# EasyEDA Pro project ProPrj_DiscoTech 6 Current_2026-05-06.epro, board Input
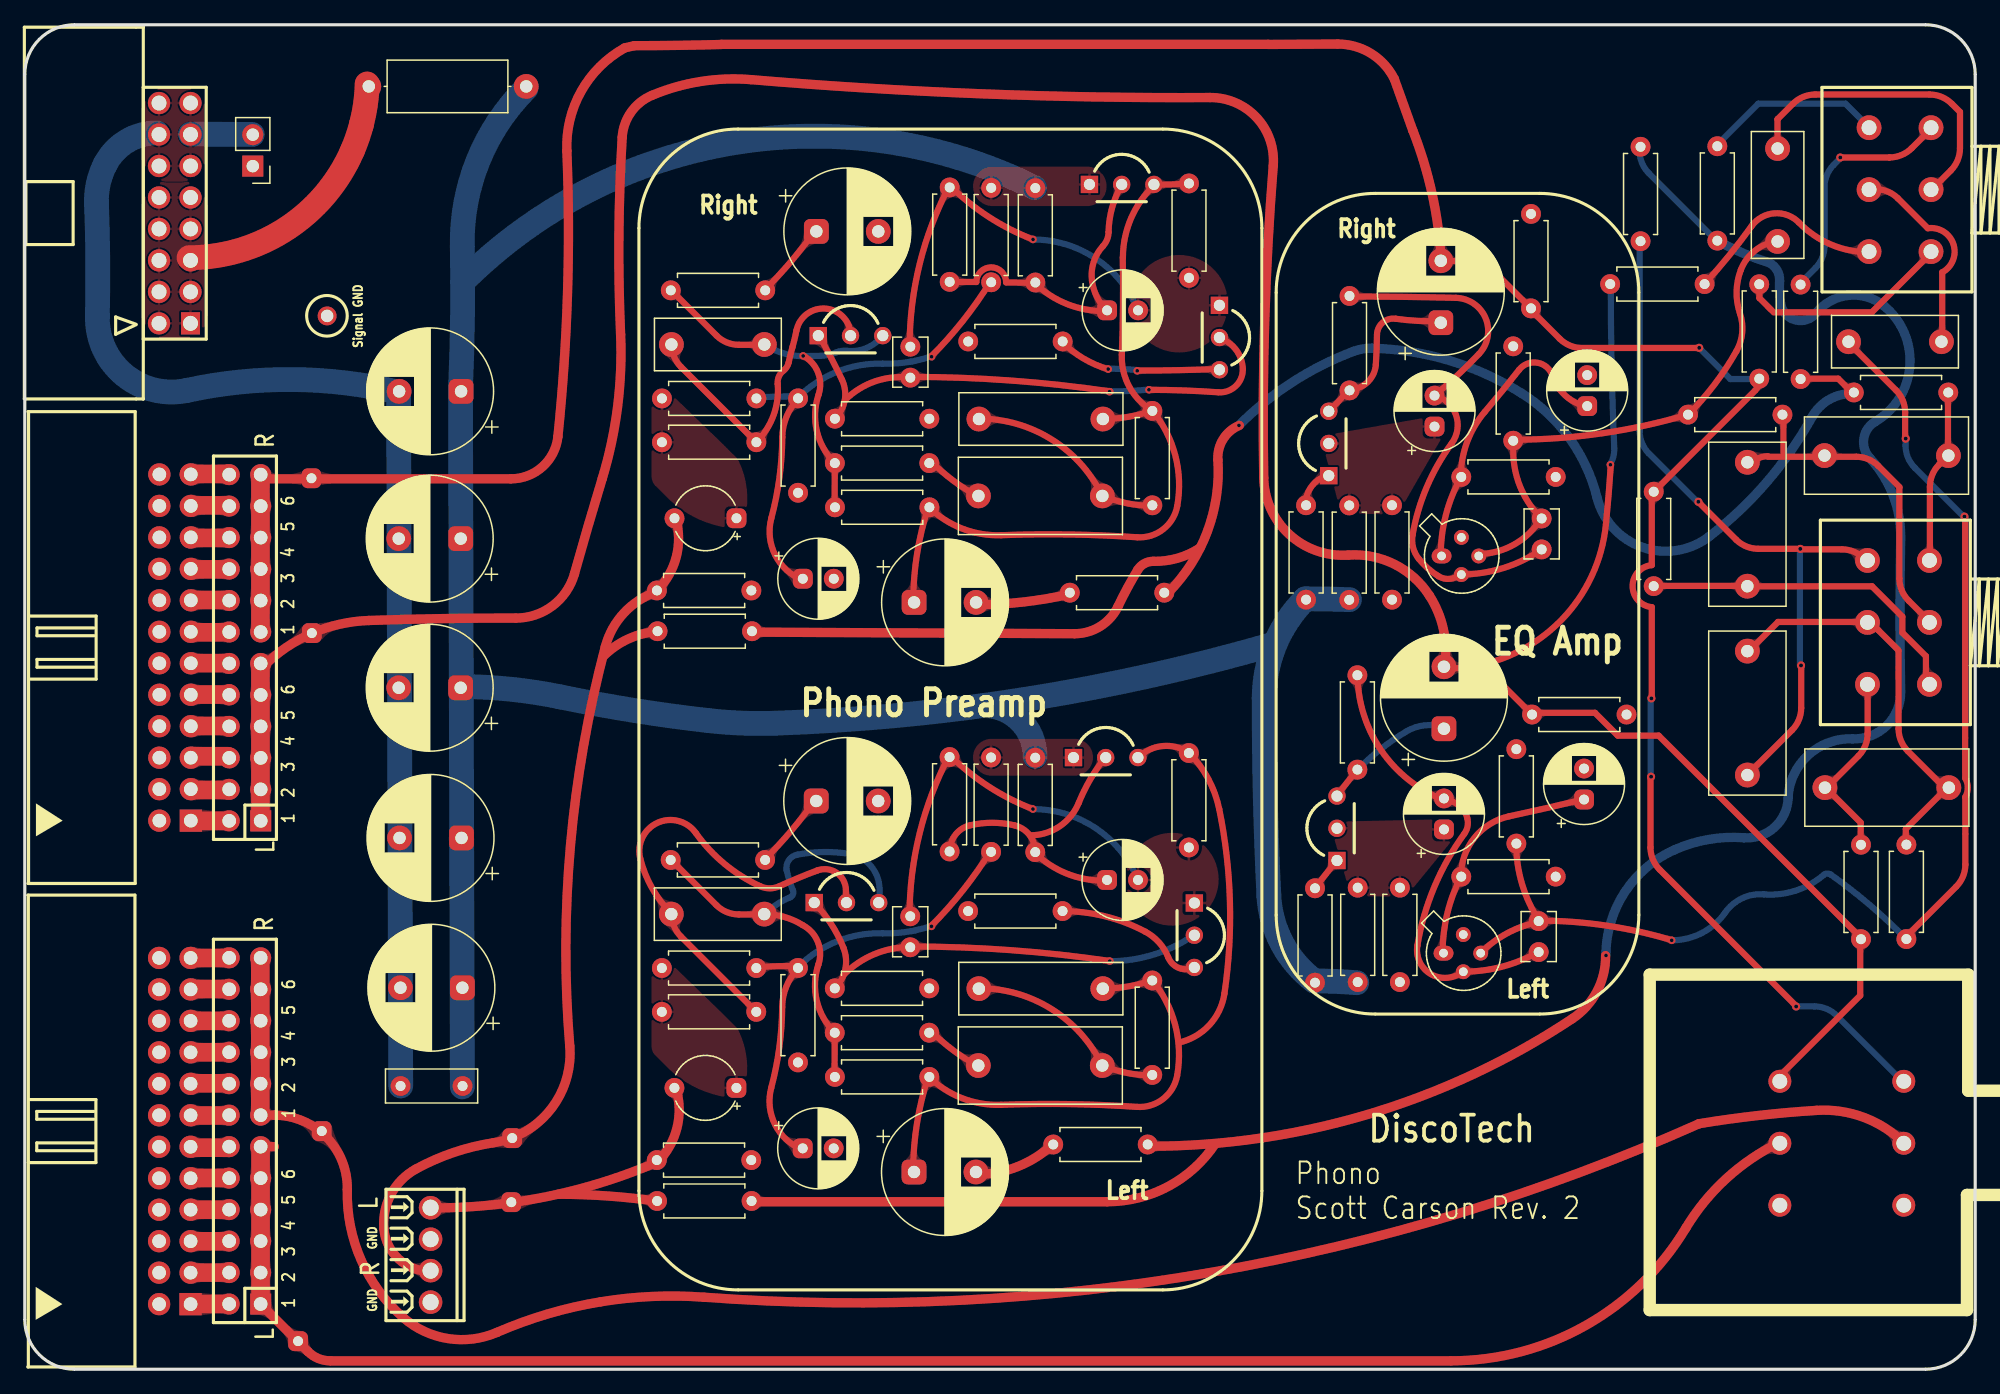
[diagram p20: board, top side]
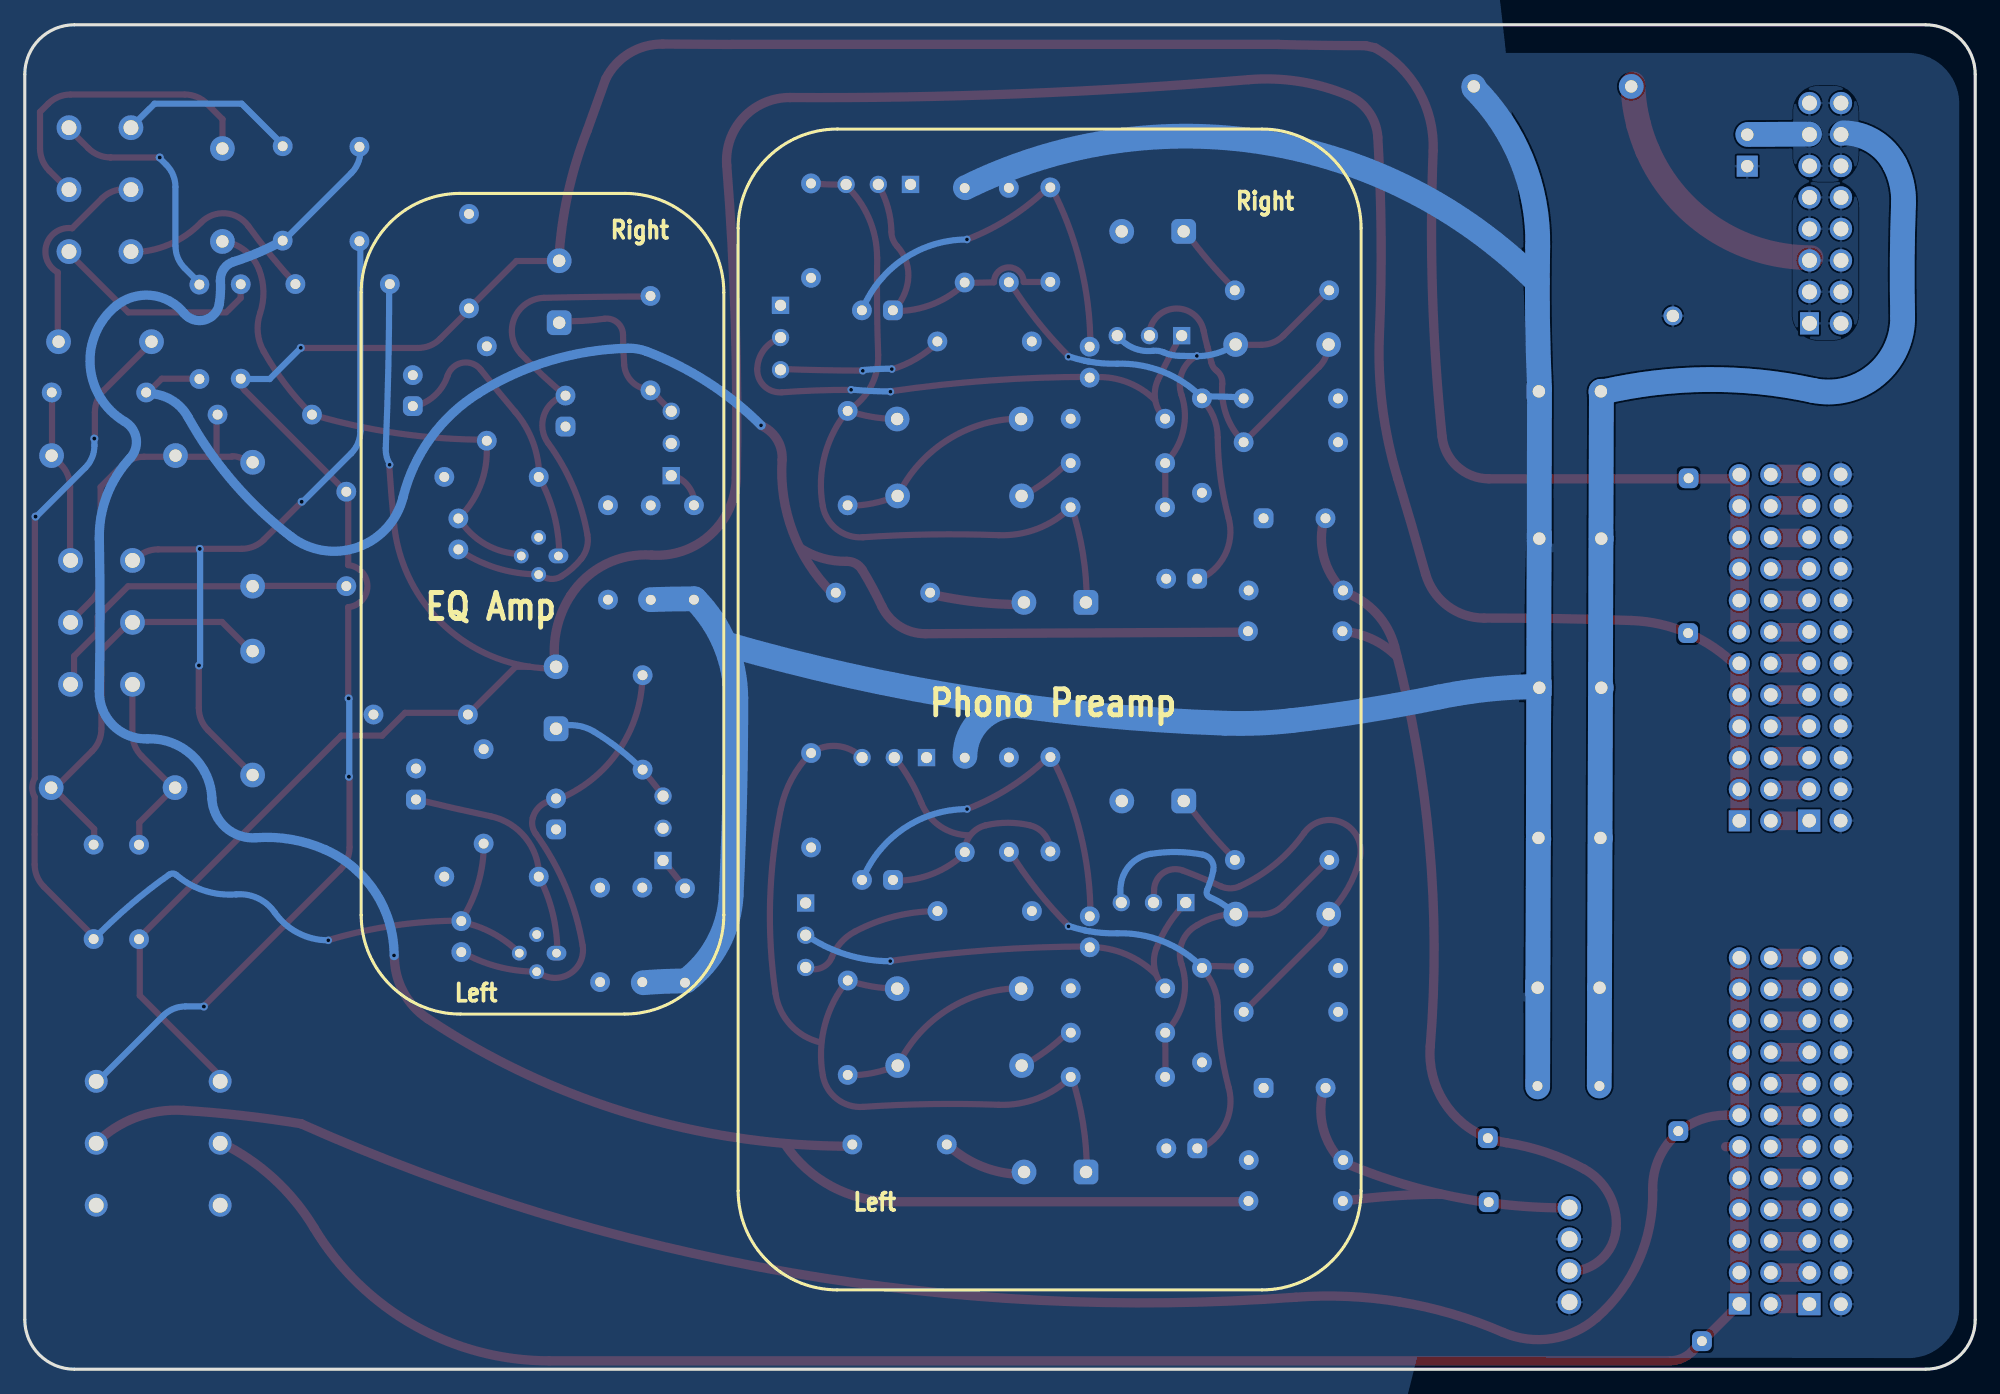
[diagram p21: board, bottom side, seen from below]

Outline 157.37 x 108.5 mm; copper layers: Top Layer, Bottom Layer. Coordinates in mm from the lower left corner of the outline.
Outline path: 0,104.5 0,4 arc(1.17,1.17) 4,0 153.37,0 arc(156.2,1.17) 157.37,4 157.37,104.5 arc(156.2,107.33) 153.37,108.5 4,108.5 arc(1.17,107.33) 0,104.5
Stack: Top Layer 0.035mm / Dielectric1 1.51mm FR4 er 4.5 / Bottom Layer 0.035mm

## Design rules (mm)
template: Custom Config
spacing copperThickness1oz (default): track to track 0.102, other pairs 0.152 to 0.3
spacing copperThickness2oz: track to track 0.203, other pairs 0.152 to 0.3
track width copperThickness1oz (default): min 0.127, default 0.75, max 2.54
track width copperThickness2oz: min 0.203, default 0.254, max 2.54
differential pair differentialPair (default): width min 0.127, default 0.254, max 2.54; gap min 0.152, default 0.152
via viaSize (default): diameter min 0.5, default 0.61, max 10; hole min 0.3, default 0.305, max 6.3

## Placement (name value [footprint] x y rotation side)
C1  47uF  [Capacitor_THT:CP_Radial_D6.3mm_P2.50mm]  125.81 45.98 90 top
C2  47uF  [Capacitor_THT:CP_Radial_D6.3mm_P2.50mm]  126.06 77.73 90 top
C3  100nF  [Capacitor_THT:C_Rect_L7.2mm_W2.5mm_P5.00mm_FKS2_FKP2_MKS2_MKP2]  30.32 22.86 0 top
C4  100 uF  [Capacitor_THT:CP_Radial_D10.0mm_P5.00mm]  63.86 45.86 0 top
C5  100uF  [Capacitor_THT:CP_Radial_D10.0mm_P5.00mm]  114.51 51.69 90 top
C6  100uF  [Capacitor_THT:CP_Radial_D10.0mm_P5.00mm]  114.25 84.46 90 top
C7  100uF  [Capacitor_THT:CP_Radial_D10.0mm_P5.00mm]  35.17 67.03 180 top
C8  10pF  [Capacitor_THT:C_Disc_D3.8mm_W2.6mm_P2.50mm]  122.15 36.16 270 top
C9  10pF  [Capacitor_THT:C_Disc_D3.8mm_W2.6mm_P2.50mm]  122.39 68.66 270 top
C10  100uF  [Capacitor_THT:CP_Radial_D10.0mm_P5.00mm]  35.17 55 180 top
C11  47uF  [Capacitor_THT:CP_Radial_D6.3mm_P2.50mm]  114.51 43.56 90 top
C12  47uF  [Capacitor_THT:CP_Radial_D6.3mm_P2.50mm]  113.75 76.07 90 top
C13  100uF  [Capacitor_THT:CP_Radial_D10.0mm_P5.00mm]  35.24 42.88 180 top
C14  100uF  [Capacitor_THT:CP_Radial_D10.0mm_P5.00mm]  35.31 30.79 180 top
C15  68nF  [Capacitor_THT:C_Rect_L13.0mm_W6.0mm_P10.00mm_FKS3_FKP3_MKS4]  145.21 73.73 0 top
C16  2.2nF  [Capacitor_THT:C_Rect_L10.0mm_W4.0mm_P7.50mm_FKS3_FKP3]  141.43 91.01 90 top
C17  68nF  [Capacitor_THT:C_Rect_L13.0mm_W6.0mm_P10.00mm_FKS3_FKP3_MKS4]  138.99 63.19 90 top
C18  68nF  [Capacitor_THT:C_Rect_L13.0mm_W6.0mm_P10.00mm_FKS3_FKP3_MKS4]  138.99 47.95 90 top
C19  68nF  [Capacitor_THT:C_Rect_L13.0mm_W6.0mm_P10.00mm_FKS3_FKP3_MKS4]  155.24 46.94 180 top
C20  2.2nF  [Capacitor_THT:C_Rect_L10.0mm_W4.0mm_P7.50mm_FKS3_FKP3]  154.65 82.92 180 top
C21  100uF  [Capacitor_THT:CP_Radial_D10.0mm_P5.00mm]  35.2 78.92 180 top
C22  22uF  [Capacitor_THT:CP_Radial_D6.3mm_P2.50mm]  62.78 63.79 0 top
C23  100 uF  [Capacitor_THT:CP_Radial_D10.0mm_P5.00mm]  63.87 91.83 0 top
C24  3.3 uF  [Capacitor_THT:CP_Radial_Tantal_D5.0mm_P5.00mm]  57.42 22.7 180 top
C25  560 pF  [Capacitor_THT:C_Rect_L10.0mm_W4.0mm_P7.50mm_FKS3_FKP3]  52.17 36.73 0 top
C26  100 uF  [Capacitor_THT:CP_Radial_D10.0mm_P5.00mm]  71.75 61.88 0 top
C27  47 uF  [Capacitor_THT:CP_Radial_D6.3mm_P2.50mm]  87.32 39.49 0 top
C28  100 uF  [Capacitor_THT:CP_Radial_D10.0mm_P5.00mm]  71.75 15.92 0 top
C29  6.8 nF  [Capacitor_THT:C_Rect_L13.0mm_W4.0mm_P10.00mm_FKS3_FKP3_MKS4]  76.99 76.68 0 top
C30  47 uF  [Capacitor_THT:CP_Radial_D6.3mm_P2.50mm]  87.33 85.45 0 top
C31  560 pF  [Capacitor_THT:C_Rect_L10.0mm_W4.0mm_P7.50mm_FKS3_FKP3]  52.17 82.7 0 top
C32  18 nF  [Capacitor_THT:C_Rect_L13.0mm_W6.0mm_P10.00mm_FKS3_FKP3_MKS4]  76.95 70.48 0 top
C33  6.8 nF  [Capacitor_THT:C_Rect_L13.0mm_W4.0mm_P10.00mm_FKS3_FKP3_MKS4]  76.98 30.71 0 top
C34  3.3 uF  [Capacitor_THT:CP_Radial_Tantal_D5.0mm_P5.00mm]  57.42 68.67 180 top
C35  22 pF  [Capacitor_THT:C_Disc_D3.8mm_W2.6mm_P2.50mm]  71.45 82.52 270 top
C36  18 nF  [Capacitor_THT:C_Rect_L13.0mm_W6.0mm_P10.00mm_FKS3_FKP3_MKS4]  76.94 24.51 0 top
C37  22 pF  [Capacitor_THT:C_Disc_D3.8mm_W2.6mm_P2.50mm]  71.44 36.55 270 top
C38  22uF  [Capacitor_THT:CP_Radial_D6.3mm_P2.50mm]  62.77 17.82 0 top
FB1  FerriteBead_Small  [Inductor_THT:L_Axial_L9.5mm_D4.0mm_P12.70mm_Horizontal_Fastron_SMCC]  27.76 103.53 0 top
H3  PZ254V-12-24P  [HDR-TH_24P-P2.54-V-M-R2-C12-S2.54]  17.76 19.23 90 top
H4  PZ254V-12-24P  [HDR-TH_24P-P2.54-V-M-R2-C12-S2.54]  17.76 58.23 90 top
J1  -  [2n3822]  116.06 33.74 0 top
J2  -  [2n3822]  115.9 65.79 0 top
JP1  GND Bridge  [Connector_PinHeader_2.54mm:PinHeader_1x02_P2.54mm_Vertical]  18.39 97.09 180 top
NOREF  -  [Pad_e307]  24.39 85 270 top
NOREF#2  -  [Pad_e2343]  23.96 19.22 90 top
NOREF#3  -  [Pad_e2347]  23.13 71.9 90 top
NOREF#4  -  [Pad_e2352]  39.26 13.48 90 top
NOREF#5  -  [Pad_e2346]  22.05 2.27 90 top
NOREF#6  -  [Pad_e2355]  39.33 18.65 90 top
NOREF#7  -  [Pad_e2348]  23.16 59.41 90 top
P1  Power  [CONN-TH_16P-P2.54_C9142]  12.1 93.29 270 top
P2  Master  [IDC-TH_24P-P2.54_ZHOURI_DC3-2.54-24PAL]  12.11 19.22 270 top
P3  Cue  [IDC-TH_24P-P2.54_ZHOURI_DC3-2.54-24PAL]  12.13 58.24 270 top
Q1  BC550  [TO-92-3_L4.8-W3.7-P2.60-L_LP0003A]  105.88 43.65 90 top
Q2  BC550  [TO-92-3_L4.8-W3.7-P2.60-L_LP0003A]  105.21 74.71 90 top
Q3  BC560  [TO-92-3_L4.8-W3.7-P2.60-L_LP0003A]  66.3 37.66 0 top
Q4  BC560  [TO-92-3_L4.8-W3.7-P2.60-L_LP0003A]  66.63 83.41 0 top
Q5  BC550  [TO-92-3_L4.8-W3.7-P2.60-L_LP0003A]  88.5 95.62 0 top
Q6  BC550  [TO-92-3_L4.8-W3.7-P2.60-L_LP0003A]  96.39 83.26 270 top
Q7  BC550  [TO-92-3_L4.8-W3.7-P2.60-L_LP0003A]  87.21 49.36 0 top
Q8  BC550  [TO-92-3_L4.8-W3.7-P2.60-L_LP0003A]  94.37 35.02 270 top
R1  470k  [Resistor_THT:R_Axial_DIN0207_L6.3mm_D2.5mm_P7.62mm_Horizontal]  110.95 38.86 270 top
R2  1M  [Resistor_THT:R_Axial_DIN0207_L6.3mm_D2.5mm_P7.62mm_Horizontal]  120.35 42.42 90 top
R3  220R  [Resistor_THT:R_Axial_DIN0207_L6.3mm_D2.5mm_P7.62mm_Horizontal]  115.9 39.75 0 top
R4  100k  [Resistor_THT:R_Axial_DIN0207_L6.3mm_D2.5mm_P7.62mm_Horizontal]  121.62 52.83 0 top
R5  470k  [Resistor_THT:R_Axial_DIN0207_L6.3mm_D2.5mm_P7.62mm_Horizontal]  110.32 69.72 270 top
R6  1M  [Resistor_THT:R_Axial_DIN0207_L6.3mm_D2.5mm_P7.62mm_Horizontal]  120.09 74.93 90 top
R7  220R  [Resistor_THT:R_Axial_DIN0207_L6.3mm_D2.5mm_P7.62mm_Horizontal]  115.9 72.01 0 top
R8  100k  [Resistor_THT:R_Axial_DIN0207_L6.3mm_D2.5mm_P7.62mm_Horizontal]  121.53 85.61 90 top
R9  470R  [Resistor_THT:R_Axial_DIN0207_L6.3mm_D2.5mm_P7.62mm_Horizontal]  107.52 48.39 90 top
R10  470R  [Resistor_THT:R_Axial_DIN0207_L6.3mm_D2.5mm_P7.62mm_Horizontal]  106.89 79 90 top
R11  220k  [Resistor_THT:R_Axial_DIN0207_L6.3mm_D2.5mm_P7.62mm_Horizontal]  107.55 31.24 90 top
R12  330R  [Resistor_THT:R_Axial_DIN0207_L6.3mm_D2.5mm_P7.62mm_Horizontal]  104.1 31.19 90 top
R13  220k  [Resistor_THT:R_Axial_DIN0207_L6.3mm_D2.5mm_P7.62mm_Horizontal]  106.87 62.09 90 top
R14  330R  [Resistor_THT:R_Axial_DIN0207_L6.3mm_D2.5mm_P7.62mm_Horizontal]  103.38 62.1 90 top
R15  Bass 50kΩ  [RES-ADJ-TH_RK16312A0BKH]  151.18 60.27 0 top
R16  Treble 50kΩ  [RES-ADJ-TH_RK16312A0BKH]  151.31 95.2 0 top
R17  6k8  [Resistor_THT:R_Axial_DIN0207_L6.3mm_D2.5mm_P7.62mm_Horizontal]  141.82 77.04 180 top
R18  12k  [Resistor_THT:R_Axial_DIN0207_L6.3mm_D2.5mm_P7.62mm_Horizontal]  131.43 70.82 270 top
R19  3k3  [Resistor_THT:R_Axial_DIN0207_L6.3mm_D2.5mm_P7.62mm_Horizontal]  143.28 79.91 90 top
R20  12k  [Resistor_THT:R_Axial_DIN0207_L6.3mm_D2.5mm_P7.62mm_Horizontal]  148.16 42.33 270 top
R21  12k  [Resistor_THT:R_Axial_DIN0207_L6.3mm_D2.5mm_P7.62mm_Horizontal]  147.58 78.83 0 top
R22  12k  [Resistor_THT:R_Axial_DIN0207_L6.3mm_D2.5mm_P7.62mm_Horizontal]  130.37 91.03 90 top
R23  6k8  [Resistor_THT:R_Axial_DIN0207_L6.3mm_D2.5mm_P7.62mm_Horizontal]  151.82 34.71 90 top
R24  3k3  [Resistor_THT:R_Axial_DIN0207_L6.3mm_D2.5mm_P7.62mm_Horizontal]  139.95 87.56 270 top
R25  3k3  [Resistor_THT:R_Axial_DIN0207_L6.3mm_D2.5mm_P7.62mm_Horizontal]  136.56 91.08 90 top
R26  3k3  [Resistor_THT:R_Axial_DIN0207_L6.3mm_D2.5mm_P7.62mm_Horizontal]  135.54 87.57 180 top
R27  8k2  [Resistor_THT:R_Axial_DIN0207_L6.3mm_D2.5mm_P7.62mm_Horizontal]  74.63 87.75 90 top
R28  150R  [Resistor_THT:R_Axial_DIN0207_L6.3mm_D2.5mm_P7.62mm_Horizontal]  93.94 95.7 270 top
R29  47R  [Resistor_THT:R_Axial_DIN0207_L6.3mm_D2.5mm_P7.62mm_Horizontal]  83.74 82.94 180 top
R30  1k  [Resistor_THT:R_Axial_DIN0207_L6.3mm_D2.5mm_P7.62mm_Horizontal]  84.32 62.67 0 top
R31  56k  [Resistor_THT:R_Axial_DIN0207_L6.3mm_D2.5mm_P7.62mm_Horizontal]  59.02 32.38 180 top
R32  56k  [Resistor_THT:R_Axial_DIN0207_L6.3mm_D2.5mm_P7.62mm_Horizontal]  62.39 78.35 270 top
R33  180k  [Resistor_THT:R_Axial_DIN0207_L6.3mm_D2.5mm_P7.62mm_Horizontal]  65.37 69.56 0 top
R34  150R  [Resistor_THT:R_Axial_DIN0207_L6.3mm_D2.5mm_P7.62mm_Horizontal]  52.12 87.07 0 top
R35  56k  [Resistor_THT:R_Axial_DIN0207_L6.3mm_D2.5mm_P7.62mm_Horizontal]  59.03 78.35 180 top
R36  56k  [Resistor_THT:R_Axial_DIN0207_L6.3mm_D2.5mm_P7.62mm_Horizontal]  62.39 32.38 270 top
R37  180k  [Resistor_THT:R_Axial_DIN0207_L6.3mm_D2.5mm_P7.62mm_Horizontal]  65.36 23.59 0 top
R38  470R  [Resistor_THT:R_Axial_DIN0207_L6.3mm_D2.5mm_P7.62mm_Horizontal]  72.98 73.13 180 top
R39  1M  [Resistor_THT:R_Axial_DIN0207_L6.3mm_D2.5mm_P7.62mm_Horizontal]  58.62 62.85 180 top
R40  1k  [Resistor_THT:R_Axial_DIN0207_L6.3mm_D2.5mm_P7.62mm_Horizontal]  59.02 28.84 180 top
R41  330k  [Resistor_THT:R_Axial_DIN0207_L6.3mm_D2.5mm_P7.62mm_Horizontal]  77.97 95.34 270 top
R42  12k  [Resistor_THT:R_Axial_DIN0207_L6.3mm_D2.5mm_P7.62mm_Horizontal]  90.97 23.75 90 top
R43  1k  [Resistor_THT:R_Axial_DIN0207_L6.3mm_D2.5mm_P7.62mm_Horizontal]  59.03 74.81 180 top
R44  47R  [Resistor_THT:R_Axial_DIN0207_L6.3mm_D2.5mm_P7.62mm_Horizontal]  83.73 36.97 180 top
R45  150R  [Resistor_THT:R_Axial_DIN0207_L6.3mm_D2.5mm_P7.62mm_Horizontal]  93.93 49.73 270 top
R46  15k  [Resistor_THT:R_Axial_DIN0207_L6.3mm_D2.5mm_P7.62mm_Horizontal]  65.36 30.74 0 top
R47  470R  [Resistor_THT:R_Axial_DIN0207_L6.3mm_D2.5mm_P7.62mm_Horizontal]  72.97 27.16 180 top
R48  100k  [Resistor_THT:R_Axial_DIN0207_L6.3mm_D2.5mm_P7.62mm_Horizontal]  81.54 95.32 270 top
R49  330k  [Resistor_THT:R_Axial_DIN0207_L6.3mm_D2.5mm_P7.62mm_Horizontal]  77.97 49.37 270 top
R50  15k  [Resistor_THT:R_Axial_DIN0207_L6.3mm_D2.5mm_P7.62mm_Horizontal]  65.36 76.71 0 top
R51  150R  [Resistor_THT:R_Axial_DIN0207_L6.3mm_D2.5mm_P7.62mm_Horizontal]  52.12 41.1 0 top
R52  8k2  [Resistor_THT:R_Axial_DIN0207_L6.3mm_D2.5mm_P7.62mm_Horizontal]  74.62 41.78 90 top
R53  100k  [Resistor_THT:R_Axial_DIN0207_L6.3mm_D2.5mm_P7.62mm_Horizontal]  81.53 49.35 270 top
R54  1M  [Resistor_THT:R_Axial_DIN0207_L6.3mm_D2.5mm_P7.62mm_Horizontal]  58.62 16.88 180 top
R55  12k  [Resistor_THT:R_Axial_DIN0207_L6.3mm_D2.5mm_P7.62mm_Horizontal]  90.98 69.72 90 top
R56  1k  [Resistor_THT:R_Axial_DIN0207_L6.3mm_D2.5mm_P7.62mm_Horizontal]  82.98 18.14 0 top
R57  NO PHONO  [Resistor_THT:R_Axial_DIN0207_L6.3mm_D2.5mm_P7.62mm_Horizontal]  58.64 13.58 180 top
R58  NO PHONO  [Resistor_THT:R_Axial_DIN0207_L6.3mm_D2.5mm_P7.62mm_Horizontal]  51.06 59.56 0 top
U1  Volume 50kΩ  [RES-ADJ-TH_RK27112A0A16]  146.61 18.23 0 top
U2  In  [CONN-TH_4P-P2.54_MX128-2.54-GN01-04P-CU-Y-A]  32.74 9.22 270 top

## Footprints (pads in the part's own frame, mm; a bottom-side part is the same pattern mirrored in y, then rotated)
2n3822
  oval 1.6x1.2 hole 0.7: 1(-1.589,-0.157)
  round 1.2 hole 0.7: 2(0.011,-1.657) 3(1.411,-0.157) 4(0.011,1.343)
Capacitor_THT:C_Disc_D3.8mm_W2.6mm_P2.50mm
  round 1.6 hole 0.8: 1(0,0) 2(2.5,0)
Capacitor_THT:C_Rect_L7.2mm_W2.5mm_P5.00mm_FKS2_FKP2_MKS2_MKP2
  round 1.6 hole 0.8: 1(0,0) 2(5,0)
Capacitor_THT:C_Rect_L10.0mm_W4.0mm_P7.50mm_FKS3_FKP3
  round 2 hole 1: 1(0,0) 2(7.5,0)
Capacitor_THT:C_Rect_L13.0mm_W4.0mm_P10.00mm_FKS3_FKP3_MKS4
  round 2 hole 1: 1(0,0) 2(10,0)
Capacitor_THT:C_Rect_L13.0mm_W6.0mm_P10.00mm_FKS3_FKP3_MKS4
  round 2 hole 1: 1(0,0) 2(10,0)
Capacitor_THT:CP_Radial_D6.3mm_P2.50mm
  rrect 1.6x1.6 hole 0.8: 1(0,0)
  round 1.6 hole 0.8: 2(2.5,0)
Capacitor_THT:CP_Radial_D10.0mm_P5.00mm
  rrect 2x2 hole 1: 1(0,0)
  round 2 hole 1: 2(5,0)
Capacitor_THT:CP_Radial_Tantal_D5.0mm_P5.00mm
  rrect 1.6x1.6 hole 0.8: 1(0,0)
  round 1.6 hole 0.8: 2(5,0)
CONN-TH_4P-P2.54_MX128-2.54-GN01-04P-CU-Y-A
  round 1.9 hole 1.3: 1(-3.81,0) 2(-1.27,0) 3(1.27,0) 4(3.81,0)
CONN-TH_16P-P2.54_C9142
  rect 1.8x1.524 hole 1.2: 1(8.89,1.27)
  round 1.8 hole 1.2: 2(8.89,-1.27) 3(6.35,1.27) 4(6.35,-1.27) 5(3.81,1.27) 6(3.81,-1.27) 7(1.27,1.27) 8(1.27,-1.27) 9(-1.27,1.27) 10(-1.27,-1.27) 11(-3.81,1.27) 12(-3.81,-1.27) 13(-6.35,1.27) 14(-6.35,-1.27) 15(-8.89,1.27) 16(-8.89,-1.27)
Connector_PinHeader_2.54mm:PinHeader_1x02_P2.54mm_Vertical
  rect 1.7x1.7 hole 1: 1(0,0)
  round 1.7 hole 1: 2(0,-2.54)
HDR-TH_24P-P2.54-V-M-R2-C12-S2.54
  rect 1.7x1.7 hole 1.1: 1(-13.97,-1.27)
  round 1.7 hole 1.1: 2(-13.97,1.27) 3(-11.43,-1.27) 4(-11.43,1.27) 5(-8.89,-1.27) 6(-8.89,1.27) 7(-6.35,-1.27) 8(-6.35,1.27) 9(-3.81,-1.27) 10(-3.81,1.27) 11(-1.27,-1.27) 12(-1.27,1.27) 13(1.27,-1.27) 14(1.27,1.27) 15(3.81,-1.27) 16(3.81,1.27) 17(6.35,-1.27) 18(6.35,1.27) 19(8.89,-1.27) 20(8.89,1.27) 21(11.43,-1.27) 22(11.43,1.27) 23(13.97,-1.27) 24(13.97,1.27)
IDC-TH_24P-P2.54_ZHOURI_DC3-2.54-24PAL
  rect 1.8x1.8 hole 1.1: 1(13.97,1.27)
  round 1.8 hole 1.1: 2(13.97,-1.27) 3(11.43,1.27) 4(11.43,-1.27) 5(8.89,1.27) 6(8.89,-1.27) 7(6.35,1.27) 8(6.35,-1.27) 9(3.81,1.27) 10(3.81,-1.27) 11(1.27,1.27) 12(1.27,-1.27) 13(-1.27,1.27) 14(-1.27,-1.27) 15(-3.81,1.27) 16(-3.81,-1.27) 17(-6.35,1.27) 18(-6.35,-1.27) 19(-8.89,1.27) 20(-8.89,-1.27) 21(-11.43,1.27) 22(-11.43,-1.27) 23(-13.97,1.27) 24(-13.97,-1.27)
Inductor_THT:L_Axial_L9.5mm_D4.0mm_P12.70mm_Horizontal_Fastron_SMCC
  round 2 hole 1: 1(0,0) 2(12.7,0)
Pad_e307
  round 1.524 hole 1: 1(0,0)
Pad_e2343
  rrect 1.6x1.6 hole 0.8: 1(0,0)
Pad_e2346
  rrect 1.6x1.6 hole 0.8: 2(0,0)
Pad_e2347
  rrect 1.6x1.6 hole 0.8: 3(0,0)
Pad_e2348
  rrect 1.6x1.6 hole 0.8: 4(0,0)
Pad_e2352
  rrect 1.6x1.6 hole 0.8: 1(0,0)
Pad_e2355
  rrect 1.6x1.6 hole 0.8: 2(0,0)
RES-ADJ-TH_RK16312A0BKH
  round 2 hole 1.2: 1(2.5,-5) 2(2.5,0) 3(2.5,5) 4(-2.5,-5) 5(-2.5,0) 6(-2.5,5)
RES-ADJ-TH_RK27112A0A16
  round 1.85 hole 1.2: 1(-5,5) 2(-5,0) 3(-5,-5) 4(5,-5) 5(5,0) 6(5,5)
Resistor_THT:R_Axial_DIN0207_L6.3mm_D2.5mm_P7.62mm_Horizontal
  round 1.6 hole 0.8: 1(0,0) 2(7.62,0)
TO-92-3_L4.8-W3.7-P2.60-L_LP0003A
  rect 1.4x1.4 hole 0.9: 1(-2.6,0)
  round 1.4 hole 0.9: 2(0,0) 3(2.6,0)

## Nets
As in the schematic, except:
GNDS: C1.2 C2.2 C4.2 C22.2 C23.2 C38.2 J1.4 J2.4 JP1.1 NOREF.1 P2.2 P2.4 P2.6 P2.8 P2.10 P2.12 P2.14 P2.16 P2.18 P2.20 P2.22 P2.24 P3.2 P3.4 P3.6 P3.8 P3.10 P3.12 P3.14 P3.16 P3.18 P3.20 P3.22 P3.24 R1.2 R2.2 R3.2 R4.2 R5.2 R6.2 R7.2 R8.2 R29.2 R32.2 R36.2 R39.1 R44.2 R46.2 R50.2 R54.1 U1.3 U1.4 U2.2 U2.4
LCUE: C5.2 H4.1 H4.3 H4.5 H4.7 H4.9 H4.11 NOREF#7.4 R4.1 R20.2 R26.2 U1.1
LOUT: H3.1 H3.3 H3.5 H3.7 H3.9 H3.11 NOREF#5.2 U1.2
RCUE: C6.2 H4.13 H4.15 H4.17 H4.19 H4.21 H4.23 NOREF#3.3 R8.1 R18.1 R24.2 U1.6
ROUT: H3.13 H3.15 H3.17 H3.19 H3.21 H3.23 NOREF#2.1 U1.5
$2N5209: C24.2 NOREF#4.1 R54.2 R57.2 U2.1
$2N5229: C34.2 NOREF#6.2 R39.2 R58.1 U2.3

## Via types
v1: diameter 0.65, hole 0.325, Top Layer to Bottom Layer, 10 vias
v2: diameter 0.61, hole 0.305, Top Layer to Bottom Layer, 14 vias

## Routing (per net, layer and track width the routed paths; a pad name or vN(x,y) marks a point on that pad's centre or on a via; arc(x,y) is an arc through that point)
40V: length 22.2
  Top Layer w2: 27.62,103.72 arc(27.48,102.05) 27.15,100.42 arc(26.83,99.37) 26.44,98.36 arc(21.14,92.06) 13.25,89.7
GNDREF: length 106.5
  Bottom Layer w2: 30.33,22.86 30.31,30.79 30.16,78.92 ; 18.35,99.65 13.37,99.68 ; 10.65,99.78 arc(8.21,99.09) 6.49,97.24 arc(5.93,95.7) 5.79,94.07 arc(5.89,89.53) 5.86,84.98 arc(8.03,80.23) 13.11,79 arc(21.61,79.87) 30.09,78.86
LCUE: length 276.3
  Top Layer w0.5: R4.1 117.76,56.69 116.64,56.69 ; 148.09,34.83 148.09,30.16 141.35,23.42 ; 148.26,34.71 131.83,51.13 128.53,51.13 126.69,52.97 122,52.97 ; 116.64,56.69 arc(115.68,56.58) 114.71,56.55 ; 116.64,56.69 arc(124.08,60.57) 127.58,68.19 arc(127.8,70.6) 127.97,73.02
  Top Layer w0.75: 114.58,56.86 arc(114.45,59.76) 113.33,62.44 arc(110.51,64.96) 106.79,65.7 arc(102.04,67.36) 99.97,71.95 arc(100.04,84.56) 100.73,97.15 arc(99.39,101.01) 95.64,102.63 arc(77.11,102.93) 58.61,104.07 arc(54.53,103.92) 50.61,102.81 arc(48.92,101.45) 48.2,99.41 arc(47.94,91.46) 48.07,83.51 arc(47.83,77.64) 46.6,71.9 arc(45.46,68.06) 44.36,64.21 arc(42.59,61.61) 39.61,60.62 arc(33.68,60.58) 27.75,60.42 arc(25.41,60.12) 23.17,59.39 arc(21.08,58.24) 19.24,56.72
  Top Layer w1.5: 19.01,56.95 19.01,44.24
  Bottom Layer w0.5: 127.97,87.47 arc(128.04,80.9) 128.25,74.32 arc(128.17,73.63) 127.9,73
  vias: v2(127.94,72.99)
LEFT: length 178.9
  Top Layer w0.75: 58.68,13.52 87.33,13.52 arc(92.27,14.76) 96.04,18.18 ; 127.55,33.38 arc(126.85,30.49) 124.86,28.28 arc(108.55,20.62) 90.73,17.99
  Bottom Layer w0.5: 130.29,98.66 130.29,98.32 arc(130.48,97.35) 131.03,96.53 136.51,91.05
  Bottom Layer w0.75: 127.57,33.38 arc(129.09,38.48) 133.14,41.93 arc(135.87,42.75) 138.72,42.89 arc(141.17,43.72) 142.27,46.06 arc(143.88,49.54) 147.47,50.87 arc(150.24,51.94) 151.36,54.69 arc(151.3,60.86) 151.36,67.04 arc(150.75,70.52) 148.88,73.52 arc(148.38,75.1) 149.3,76.47 arc(152.1,80.95) 150.02,85.81 arc(147.16,86.66) 144.53,85.23 arc(142.85,84.68) 141.67,86 arc(141.58,86.92) 141.59,87.84 arc(141.32,88.79) 140.52,89.38 arc(138.51,90.12) 136.58,91.07
  vias: v2(127.58,33.39)
LOUT: length 144.8
  Top Layer w0.75: 20.13,17.96 H3.11 ; 18.94,5.34 22.86,1.42 arc(23.68,0.87) 24.65,0.67 115.07,0.67 arc(125.96,3.54) 134.02,11.39 arc(137.29,15.39) 141.56,18.3
  Top Layer w1.5: 19.02,5.37 19.02,17.97
RCUE: length 250.7
  Top Layer w0.5: 131.51,70.88 139.62,78.99 arc(139.91,79.43) 140.02,79.95 ; 114.29,89.44 114.19,89.44 ; 114.29,89.44 117.7,89.44 121.43,85.71 ; 135.07,82.42 125.65,82.42 arc(124.67,82.61) 123.85,83.16 121.45,85.56 ; 142.95,29.28 131.91,40.32 arc(131.36,41.15) 131.17,42.12 131.17,47.81 ; 131.28,70.78 131.28,64.89 arc(129.73,63.2) 131.28,61.5 131.28,54.2 arc(131.27,54.16) 131.25,54.12
  Top Layer w0.75: 19.31,71.86 39.23,71.86 arc(41.78,72.84) 43.02,75.28 arc(43.79,86.79) 43.74,98.32 arc(44.89,103.13) 48.4,106.63 ; 100.31,106.91 105.92,106.94 arc(108.6,106.2) 110.48,104.16 ; 111.98,100.01 110.5,104.13 ; 48.41,106.64 49.14,106.8 ; 56.2,106.92 100.31,106.92 ; 114.29,89.32 arc(114.29,89.38) 114.29,89.44 arc(113.56,94.81) 111.99,99.99 ; 49.18,106.81 arc(52.69,106.84) 56.2,106.91
  Top Layer w1.5: 19.01,59.5 19.01,72.23
  Bottom Layer w0.5: 151.55,23.18 146.19,28.54 arc(145.37,29.09) 144.4,29.28 142.93,29.28 ; 131.19,54.1 131.19,47.82 ; 139.9,79.91 137.62,79.91 135.09,82.43
  vias: v1(131.24,54.14) v1(131.22,47.82) v1(135.1,82.43) v1(142.92,29.27)
RIGHT: length 123.3
  Top Layer w0.5: 143.35,79.94 146.32,79.94 147.48,78.78
  Top Layer w0.75: 58.77,59.48 84.7,59.36 arc(86.78,59.95) 88.22,61.57 arc(88.97,63.06) 89.8,64.5 arc(90.34,65.02) 91.06,65.2 arc(93.02,65.45) 94.81,66.27 ; 92.22,62.64 arc(95.4,67.57) 96.27,73.38 arc(96.69,75.05) 98,76.17
  Bottom Layer w0.75: 97.96,76.18 arc(102.26,79.65) 107.2,82.14 arc(107.94,82.34) 108.7,82.39 arc(114.97,81.4) 120.75,78.77 arc(124.62,75.16) 126.86,70.35 arc(130.52,66.33) 135.89,67.19 arc(140.55,71.59) 144.21,76.85 arc(145.63,78.27) 147.58,78.73
  vias: v2(97.97,76.17)
ROUT: length 159.7
  Top Layer w0.75: H3.13 20.13,20.5 arc(22.13,20.15) 23.9,19.14 arc(25.5,17.05) 26.02,14.47 arc(27.14,8.81) 30.54,4.16 arc(34.16,2.47) 38.11,2.98 arc(42.21,4.47) 46.47,5.44 arc(50.63,5.87) 54.81,5.81 arc(95.82,7.84) 135.1,19.81 ; 135.1,19.81 arc(135.09,19.81) 135.08,19.81 ; 135.1,19.81 arc(139.83,20.47) 144.58,20.89 arc(148.41,20.31) 151.67,18.21
  Top Layer w1.5: 19,33.19 19,20.54
VDC: length 243.9
  Bottom Layer w2: 35.3,22.79 35.25,42.8 arc(35.23,42.8) 35.21,42.8 ; 35.16,78.95 35.22,55.09 ; 35.22,55.09 35.25,43.19 ; 35.22,55.09 arc(39.27,54.87) 43.27,54.25 arc(49.2,53.16) 55.17,52.34 arc(57.85,52.14) 60.53,52.13 arc(80.84,54.08) 100.75,58.51 ; 107.47,31.19 arc(105.76,31.3) 104.04,31.33 arc(101.44,34.38) 100.38,38.24 arc(100.09,46.19) 100,54.15 arc(100.86,58.46) 103.28,62.12 arc(103.31,62.15) 103.34,62.18 ; 35.33,87.76 arc(57.19,98.98) 81.48,95.35 ; 103.43,62.17 arc(105.16,62.16) 106.89,62.11 ; 81.51,49.46 arc(80.31,52.36) 77.41,53.56 ; 35.16,79.21 arc(35.32,84.91) 35.3,90.62 arc(36.57,97.52) 40.44,103.37
$1N449: length 98.8
  Top Layer w0.5: 156.58,43.19 156.57,46.18 arc(156.77,46.94) 156.56,47.7 156.56,50.95 ; 151.7,34.81 155.83,38.94 arc(156.38,39.77) 156.58,40.74 156.58,43.13 ; 156.56,50.95 156.56,68.61 arc(156.54,68.7) 156.49,68.77 ; 151.72,75.04 151.72,77.22 arc(151.52,78.19) 150.97,79.01 147.09,82.9 ; 117.48,33.6 arc(119.63,35.2) 122.15,36.09 ; 122.17,36.2 arc(122.18,36.2) 122.18,36.2 ; 122.18,36.2 arc(127.57,35.81) 132.85,34.63 ; 122.18,36.2 arc(120.81,39.16) 120.34,42.38
  Bottom Layer w0.5: 156.47,68.78 152.5,72.75 arc(151.95,73.57) 151.75,74.54 151.75,75.06 ; 132.9,34.62 arc(135.33,35.21) 137.21,36.86 arc(138.57,38.01) 140.31,38.32 arc(142.89,38.62) 145.15,39.89 arc(145.43,40) 145.72,39.92 arc(148.84,37.49) 151.73,34.8
  vias: v1(151.77,75.11) v1(156.51,68.81) v2(132.88,34.61)
$1N454: length 38.7
  Top Layer w0.5: 116.11,32.08 arc(119.23,32.49) 122.14,33.69 ; 116.07,32.14 arc(113.49,31.86) 112.36,34.2 arc(113.73,38.93) 116.15,43.21 arc(116.41,43.83) 116.39,44.49 arc(115.69,45.53) 114.51,45.93 arc(109.44,49.94) 107.53,56.11
$1N461: length 10.8
  Top Layer w0.5: 105.87,46.31 107.54,48.42
  Bottom Layer w0.5: 114.5,51.8 arc(112.94,51.96) 111.45,51.46 arc(109.42,50.06) 107.58,48.43
$1N476: length 19.3
  Top Layer w0.5: 115.88,39.8 arc(116.98,42.9) 119.78,44.62 arc(122.8,45.29) 125.8,46 ; 114.4,33.64 arc(114.79,36.82) 115.92,39.82
$1N480: length 2.8
  Top Layer w0.5: 104.11,38.86 105.87,41.09
$1N855: length 44.6
  Top Layer w0.5: 134.21,77.04 arc(134.22,77.05) 134.23,77.06 ; 134.23,77.06 arc(136.34,79.48) 138.1,82.16 arc(138.57,83.65) 138.39,85.21 arc(138.12,86.98) 138.47,88.74 arc(139.63,90.29) 141.42,91.03 ; 134.23,77.06 arc(127.27,75.53) 120.15,75.01 arc(120.51,71.62) 122.32,68.72 ; 134.23,77.06 arc(134.31,77.08) 134.38,77.1 ; 117.24,65.79 arc(120.2,66.57) 122.38,68.73
$1N860: length 45.8
  Top Layer w0.5: 113.75,78.59 arc(115.47,77.03) 115.14,74.73 arc(113.13,71.21) 111.98,67.34 arc(112.02,66.32) 112.47,65.4 arc(113.21,64.63) 114.07,63.99 arc(115,63.79) 115.87,64.2 ; 113.75,78.59 arc(113.74,78.58) 113.74,78.58 ; 113.75,78.59 arc(113.74,78.59) 113.73,78.59 ; 113.75,78.59 arc(115.6,80.21) 117.34,81.95 arc(117.87,84.82) 115.46,86.46 arc(111.15,86.54) 106.84,86.57 ; 115.91,64.14 arc(119.32,64.66) 122.41,66.18
$1N867: length 13.9
  Top Layer w0.5: 114.18,84.59 arc(112.39,84.6) 110.61,84.78 arc(109.56,84.47) 109.1,83.48 arc(109.07,82.27) 109.01,81.07 arc(108.33,79.65) 106.86,79.07 arc(106.05,78.17) 105.21,77.3
$1N882: length 24
  Top Layer w0.5: 126.08,77.68 arc(124.33,78.55) 123.26,80.18 arc(122.05,81.23) 120.57,80.65 arc(119.2,78.94) 117.8,77.26 arc(116.37,74.81) 115.87,72.01 ; 114.25,65.69 arc(114.67,68.96) 115.89,72.01
$1N886: length 3.3
  Top Layer w0.5: 103.33,69.76 arc(103.85,71.28) 105.2,72.16
$1N6655: length 57.9
  Top Layer w0.5: 138.95,47.93 142.59,51.57 arc(143.14,52.4) 143.33,53.37 143.33,56.83 ; 135.02,70.01 138.07,66.95 arc(138.9,66.4) 139.87,66.21 142.96,66.21 ; 148.54,65.29 148.41,65.42 arc(147.59,65.97) 146.61,66.17 143.19,66.17
  Bottom Layer w0.5: 134.92,70.02 131.04,73.91 arc(130.49,74.73) 130.3,75.7 130.3,91.01 ; 143.23,56.77 143.23,66.22
  vias: v1(135.03,70.01) v1(143.26,66.2) v1(143.32,56.8)
$1N6656: length 15.5
  Top Layer w0.5: 148.69,55.31 148.69,51.28 arc(148.5,50.31) 147.95,49.49 145.36,46.9 ; 145.23,47.01 148.13,44.11 148.13,42.44
$1N6657: length 32.5
  Top Layer w0.5: 151.77,42.41 151.77,43.6 155.22,47.05 ; 151.18,58.02 149.57,59.63 arc(149.09,60.05) 148.57,60.41 ; 151.19,57.95 151.19,51.69 arc(151.38,50.71) 151.93,49.89 154.96,46.86 ; 139.14,57.99 141.46,60.31 148.57,60.31
$1N6659: length 14.1
  Top Layer w0.5: 155.17,73.68 155.17,73.72 ; 155.17,73.72 155.17,78.85 155.22,78.9 ; 155.17,73.72 155.24,73.79 ; 153.72,65.38 153.72,71.21 arc(153.91,72.19) 154.46,73.01 155.15,73.7
$1N6660: length 27.4
  Top Layer w0.5: 139.07,63.18 149.04,63.18 151.49,60.73 151.49,59.45 153.4,57.54 153.4,55.53 153.67,55.26 153.68,55.25 ; 131.5,63.22 138.98,63.22 ; 139.1,63.3 139.15,63.25
$1N6661: length 27.9
  Top Layer w0.5: 141.9,77.18 141.9,73.99 ; 153.65,60.38 152,62.03 arc(151.45,62.85) 151.25,63.82 151.25,71.18 ; 151.26,71.19 149.56,72.9 arc(148.73,73.45) 147.76,73.64 140.65,73.64 ; 139.3,73.13 arc(139.92,73.54) 140.65,73.68
$1N6663: length 25.8
  Top Layer w0.5: 141.42,98.21 141.42,100.87 arc(141.42,100.88) 141.43,100.89 142.67,102.13 arc(143.49,102.68) 144.47,102.87 153.69,102.87 arc(154.66,102.68) 155.48,102.13 156.14,101.47 156.14,98.53 arc(155.95,97.56) 155.4,96.74 153.75,95.09
$1N6664: length 16.8
  Top Layer w0.5: 148.75,95.23 149.34,95.23 arc(150.32,95.04) 151.14,94.49 153.55,92.08 arc(155.62,90.79) 154.71,88.52 154.71,83.02
$1N6665: length 19.4
  Top Layer w0.5: v1(146.48,97.79) 150.44,97.79 150.45,97.79 arc(151.42,97.99) 152.24,98.54 153.91,100.2
  Bottom Layer w0.5: 145.22,92.34 145.22,95.41 arc(145.41,96.38) 145.96,97.2 146.56,97.8 ; 145.22,92.2 145.22,90.66 arc(145.02,89.68) 144.47,88.86 143.3,87.69
$1N6666: length 17.2
  Top Layer w0.5: 140.97,85.43 139.96,86.45 139.96,87.46 ; 141.12,85.29 149.02,85.29 153.87,90.15
$1N6667: length 16.7
  Top Layer w0.5: 135.54,87.59 arc(137.5,89.87) 139.33,92.25 arc(141.18,93.29) 143.15,92.53 arc(145.74,90.76) 148.81,90.14
$1N6668: length 14.4
  Bottom Layer w0.5: 148.86,100.17 146.9,102.13 139.87,102.13 136.61,98.87
$1N19497: length 3.1
  Top Layer w1.5: 13.33,33.19 16.43,33.19 16.46,33.22
$1N19499: length 3.1
  Top Layer w1.5: 13.36,30.65 13.39,30.68 16.43,30.68
$1N19501: length 3.1
  Top Layer w1.5: 13.33,28.15 13.36,28.12 16.46,28.12
$1N19503: length 3.1
  Top Layer w1.5: 13.33,25.61 13.36,25.58 16.46,25.58
$1N19505: length 3
  Top Layer w1.5: 16.43,23.07 13.49,23.07 13.42,23.01
$1N19507: length 3.1
  Top Layer w1.5: 16.46,20.48 13.36,20.48 13.33,20.45
$1N19509: length 3.2
  Top Layer w1.5: 13.27,18 13.39,17.88 16.37,17.88
$1N19511: length 3.1
  Top Layer w1.5: 16.4,15.5 16.33,15.44 13.36,15.44
$1N19513: length 3.1
  Top Layer w1.5: 16.46,12.87 13.39,12.87 13.36,12.9
$1N19515: length 3.1
  Top Layer w1.5: 16.47,10.32 13.36,10.32
$1N19517: length 3.1
  Top Layer w1.5: 16.49,7.8 13.36,7.8
$1N19519: length 3.1
  Top Layer w1.5: 13.36,5.31 13.4,5.27 16.47,5.27
$1N19633: length 3.1
  Top Layer w1.5: 13.25,72.22 13.28,72.25 16.35,72.25
$1N19635: length 3.1
  Top Layer w1.5: 16.38,69.72 13.28,69.72
$1N19637: length 3.1
  Top Layer w1.5: 13.31,66.99 13.41,67.09 16.41,67.09
$1N19639: length 3.1
  Top Layer w1.5: 13.37,64.61 13.44,64.55 16.47,64.55
$1N19641: length 3.1
  Top Layer w1.5: 16.41,62.08 13.44,62.08 13.34,61.98
$1N19643: length 3.1
  Top Layer w1.5: 13.39,59.52 13.44,59.47 16.49,59.47
$1N19645: length 3.1
  Top Layer w1.5: 16.49,56.98 13.39,56.98
$1N19647: length 3.1
  Top Layer w1.5: 13.39,54.45 16.4,54.45 16.49,54.54
$1N19649: length 3.1
  Top Layer w1.5: 16.4,51.96 16.35,51.91 13.34,51.91
$1N19651: length 3.1
  Top Layer w1.5: 13.34,49.38 13.44,49.47 16.4,49.47
$1N19653: length 3.1
  Top Layer w1.5: 16.44,46.84 16.35,46.75 13.39,46.75
$1N19655: length 3
  Top Layer w1.5: 16.44,44.26 13.44,44.26
$2N1482: length 38.9
  Top Layer w0.5: 73.11,35.75 arc(75.69,38.65) 77.93,41.82 ; 62.41,32.33 arc(61.46,30.91) 61.11,29.23 arc(60.88,25.94) 60.23,22.72 arc(60.54,19.74) 62.75,17.72 ; 62.41,32.54 arc(60.71,32.52) 59.01,32.46
  Bottom Layer w0.5: 62.41,32.47 arc(65.53,34.53) 69.22,35.18 arc(70.38,35.21) 71.53,35.35 arc(71.67,35.37) 71.81,35.41 arc(72.49,35.57) 73.16,35.78
  vias: v2(73.16,35.74)
$2N1488: length 38.7
  Top Layer w0.5: 66.28,37.65 66.25,38.69 arc(65.5,40.07) 63.94,40.25 arc(62.4,39.64) 60.87,38.97 arc(60.11,38.81) 59.34,38.97 arc(56.46,40.78) 54.15,43.27 arc(51.04,44.09) 49.66,41.19 arc(50.63,38.8) 52.19,36.76 ; 58.99,28.87 52.93,34.92 arc(52.39,35.74) 52.19,36.71
$2N1493: length 16.5
  Top Layer w0.5: 86.93,70.51 arc(86.93,70.5) 86.94,70.48 ; 86.93,70.51 arc(82.85,75.04) 76.99,76.72 ; 86.93,70.51 arc(88.89,69.89) 90.93,69.68 ; 86.93,70.51 arc(86.91,70.51) 86.9,70.52
$2N1508: length 24.9
  Top Layer w0.5: 87.15,49.33 arc(85.97,47.6) 85.04,45.72 arc(83.49,43.81) 81.14,43.09 ; 74.64,41.83 arc(75.1,43.15) 76.28,43.89 arc(78.06,44.1) 79.83,43.89 arc(81.04,43.14) 81.53,41.8 ; 81.42,41.75 arc(84.08,40) 87.21,39.43
$2N1517: length 64.7
  Top Layer w0.5: 93.89,95.68 arc(92.53,95.62) 91.18,95.59 arc(89.28,92.92) 88.6,89.7 ; 88.59,89.71 arc(88.61,85.79) 88.52,81.87 arc(89.11,79.3) 90.92,77.39 ; 72.91,69.62 arc(72.92,69.61) 72.92,69.61 ; 72.92,69.61 arc(72,65.82) 71.69,61.93 ; 72.92,69.61 arc(72.93,69.65) 72.95,69.69 ; 72.92,69.61 arc(75.62,67.85) 78.79,67.31 arc(84.27,67.37) 89.75,67.14 arc(91.85,67.78) 92.99,69.66 arc(92.82,73.77) 90.93,77.43 ; 87.01,76.69 arc(89.02,76.86) 90.97,77.36
$2N1537: length 32.4
  Top Layer w0.5: 71.39,82.52 arc(72.21,89.23) 74.63,95.54 arc(77.76,93.01) 81.35,91.18
  Bottom Layer w0.5: 81.35,91.17 arc(86.42,89.64) 89.78,85.54
  vias: v2(81.35,91.18)
$2N1546: length 41.6
  Top Layer w0.5: 59.66,36.7 57.6,36.7 arc(56.63,36.9) 55.81,37.45 52.18,41.07 ; 65.33,23.65 65.35,27.23 ; 59.68,36.73 arc(61.28,36.5) 62.76,35.84 ; 62.79,35.83 arc(63.99,34.48) 64.04,32.67 arc(63.9,29.75) 65.33,27.19
  Bottom Layer w0.5: 59.72,36.76 59.72,36.74 ; 68.87,37.69 arc(68.98,38.46) 68.92,39.24 arc(68.1,40.8) 66.53,41.59 arc(64.42,41.74) 62.33,41.53 arc(61.63,41.07) 61.48,40.25 arc(61.69,39.44) 61.98,38.66 arc(61.98,38.32) 61.74,38.08 arc(60.65,37.5) 59.7,36.71
$2N1566: length 4.7
  Top Layer w0.5: 73.16,73.23 arc(74.95,71.68) 76.94,70.42
$2N1568: length 32.4
  Top Layer w0.5: 71.39,36.56 arc(72.21,43.26) 74.62,49.57 arc(77.75,47.04) 81.34,45.21
  Bottom Layer w0.5: 81.34,45.2 arc(86.41,43.67) 89.77,39.57
  vias: v2(81.34,45.21)
$2N1577: length 37.2
  Top Layer w0.5: 71.49,34.11 arc(79.56,33.82) 87.59,32.94 ; 65.38,30.76 arc(66.2,32.27) 66.06,33.99 arc(65.05,35.95) 63.66,37.67 ; 66.1,31.86 arc(68.53,33.49) 71.4,34.08
  Bottom Layer w0.5: 87.55,32.93 arc(91.1,33.47) 94.32,35.03
  vias: v2(87.54,32.94)
$2N1583: length 16.5
  Top Layer w0.5: 76.98,30.75 arc(82.84,29.07) 86.92,24.54 ; 86.92,24.54 arc(86.91,24.55) 86.89,24.55 ; 86.92,24.54 arc(86.92,24.53) 86.93,24.51 ; 86.92,24.54 arc(88.88,23.92) 90.93,23.71
$2N1588: length 25.5
  Top Layer w0.5: 74.73,87.75 arc(75.75,87.75) 76.77,87.74 arc(77.99,88.92) 79.18,87.71 arc(80.31,87.69) 81.45,87.67 ; 88.5,95.57 arc(87.73,93.74) 87.45,91.78 arc(87.32,91.16) 86.99,90.64 arc(86.24,89.34) 86.11,87.84 arc(86.51,86.54) 87.31,85.42 ; 81.42,87.72 arc(84.08,85.97) 87.22,85.4
$2N1594: length 7.5
  Top Layer w0.75: 76.82,61.71 arc(80.56,61.91) 84.25,62.54
$2N1596: length 44.5
  Top Layer w0.5: 65.39,76.72 arc(66.16,78.21) 65.93,79.86 arc(65.02,81.69) 64.05,83.47 ; 96.37,83.23 arc(97.73,82.28) 98.28,80.72 arc(97.71,79.34) 96.31,78.84 arc(93.53,78.99) 90.75,79.04 ; 66.17,78.2 arc(68.59,79.72) 71.42,80.03 ; 71.5,80.08 arc(79.57,79.79) 87.6,78.91
  Bottom Layer w0.5: 87.52,78.91 arc(89.09,78.95) 90.66,79.06
  vias: v2(87.53,78.89) v2(90.7,79.04)
$2N1602: length 72.6
  Top Layer w0.5: 93.93,49.75 arc(95.48,47.66) 96.37,45.22 arc(97.24,37.78) 96.8,30.31 arc(95.57,27.76) 93.11,26.36 ; 71.68,15.96 arc(71.99,19.85) 72.91,23.64 ; 72.91,23.64 arc(72.91,23.64) 72.91,23.65 ; 72.91,23.64 arc(72.92,23.68) 72.94,23.72 ; 72.91,23.64 arc(75.61,21.88) 78.78,21.34 arc(84.27,21.4) 89.75,21.17 arc(91.84,21.81) 92.98,23.69 arc(92.82,27.8) 90.92,31.46 ; 89.83,49.36 arc(91.82,50.29) 93.94,49.74 ; 87,30.72 arc(89.01,30.89) 90.96,31.39
$2N1622: length 38.9
  Top Layer w0.5: 62.42,78.3 arc(61.46,76.88) 61.12,75.2 arc(60.88,71.91) 60.24,68.69 arc(60.55,65.71) 62.76,63.69 ; 73.12,81.72 arc(75.7,84.62) 77.93,87.79
  Bottom Layer w0.5: 73.17,81.75 arc(72.5,81.54) 71.82,81.38 arc(71.68,81.34) 71.54,81.32 arc(70.39,81.18) 69.23,81.15 arc(65.54,80.5) 62.41,78.44 ; 62.42,78.51 arc(60.72,78.49) 59.02,78.43
  vias: v2(73.17,81.71)
$2N1628: length 32.6
  Top Layer w0.5: 52.19,87.04 55.82,83.42 arc(56.64,82.87) 57.61,82.67 59.67,82.67 ; 65.34,69.61 65.36,73.2 ; 62.79,81.8 arc(64,80.45) 64.05,78.64 arc(63.91,75.72) 65.33,73.16
  Bottom Layer w0.5: 59.72,82.73 59.72,82.71 ; 62.81,81.76 arc(63.5,81.77) 64.19,81.78 arc(64.85,81.86) 65.48,82.06 arc(65.9,82.18) 66.33,82.19 arc(67.96,82.43) 69.24,83.46 ; 62.8,81.76 arc(61.16,82) 59.67,82.71
  vias: v2(62.8,81.77)
$2N1635: length 6.9
  Top Layer w0.75: 76.8,15.72 arc(80.15,16.37) 83.02,18.22
$2N1637: length 26.8
  Top Layer w0.5: 59,74.84 52.94,80.89 arc(52.39,81.71) 52.2,82.68 ; 59.03,74.82 arc(60.41,76.98) 60.75,79.52 arc(60.85,80.12) 61.22,80.59 arc(61.48,80.88) 61.63,81.24 arc(61.78,81.87) 61.94,82.5 arc(62.12,83.15) 62.26,83.81 arc(64.62,85.59) 66.65,83.43
$2N1642: length 13.4
  Top Layer w0.5: 89.76,80.59 arc(93.06,80.63) 96.36,80.72 ; 83.66,82.93 arc(85.41,81.57) 87.44,80.69
  Bottom Layer w0.5: 87.44,80.74 arc(88.63,80.71) 89.81,80.63
  vias: v2(87.41,80.71) v2(89.76,80.57)
$2N1644: length 6.2
  Top Layer w0.5: 59.75,87.15 arc(61.86,89.44) 63.77,91.89
$2N1646: length 4.7
  Top Layer w0.5: 73.15,27.26 arc(74.94,25.72) 76.93,24.45
$2N1648: length 12.4
  Top Layer w0.5: 83.74,36.97 arc(87.17,36.55) 90.4,35.32 arc(91.51,34.45) 92.26,33.24 arc(93.16,32.37) 94.41,32.46
$2N1650: length 6.2
  Top Layer w0.5: 59.75,41.18 arc(61.85,43.47) 63.76,45.92
$2N5209: length 32.9
  Top Layer w0.75: 52.55,22.63 arc(52.63,19.48) 51.07,16.74 arc(45.28,14.69) 39.26,13.44 arc(36.17,13.13) 33.06,13.02 ; 43.07,14.12 arc(47.06,13.98) 51.03,13.56
$2N5229: length 79
  Top Layer w0.75: 51.03,62.87 arc(52.57,65.57) 52.51,68.68 ; 32.72,7.89 arc(30.17,8.89) 28.97,11.35 arc(29.56,14.14) 31.57,16.16 arc(34.6,17.49) 37.82,18.28 arc(38.58,18.43) 39.32,18.67 arc(42.88,21.59) 43.97,26.06 arc(44.03,42.31) 46.84,58.3 arc(48.34,61.03) 50.94,62.73 ; 46.66,57.52 arc(48.68,58.93) 51.05,59.55

## Copper pours and planes (outline as drawn; the poured copper is in the pictures)
40V on Top Layer: 9.52,93.78 9.54,94.06 9.61,94.34 9.7,94.61 9.84,94.86 10.01,95.09 10.21,95.29 10.44,95.46 10.69,95.6 10.96,95.7 11.24,95.76 11.52,95.78 12.65,95.78 12.93,95.76 13.21,95.7 13.48,95.6 13.73,95.46 13.96,95.29 14.16,95.09 14.33,94.86 14.47,94.61 14.57,94.34 14.63,94.06 14.65,93.78 14.65,85.16 14.63,84.87 14.57,84.59 14.47,84.32 14.33,84.07 14.16,83.85 13.96,83.64 13.73,83.47 13.48,83.34 13.21,83.24 12.93,83.18 12.65,83.16 11.52,83.16 11.24,83.18 10.96,83.24 10.69,83.34 10.44,83.47 10.21,83.64 10.01,83.85 9.84,84.07 9.7,84.32 9.61,84.59 9.54,84.87 9.52,85.16
40V on Bottom Layer: 9.52,93.78 9.54,94.06 9.61,94.34 9.7,94.61 9.84,94.86 10.01,95.09 10.21,95.29 10.44,95.46 10.69,95.6 10.96,95.7 11.24,95.76 11.52,95.78 12.65,95.78 12.93,95.76 13.21,95.7 13.48,95.6 13.73,95.46 13.96,95.29 14.16,95.09 14.33,94.86 14.47,94.61 14.57,94.34 14.63,94.06 14.65,93.78 14.65,85.16 14.63,84.87 14.57,84.59 14.47,84.32 14.33,84.07 14.16,83.85 13.96,83.64 13.73,83.47 13.48,83.34 13.21,83.24 12.93,83.18 12.65,83.16 11.52,83.16 11.24,83.18 10.96,83.24 10.69,83.34 10.44,83.47 10.21,83.64 10.01,83.85 9.84,84.07 9.7,84.32 9.61,84.59 9.54,84.87 9.52,85.16
GNDREF on Top Layer: 9.52,101.48 9.54,101.77 9.6,102.04 9.7,102.31 9.84,102.56 10.01,102.79 10.21,102.99 10.44,103.16 10.69,103.3 10.96,103.4 11.24,103.46 11.52,103.48 12.59,103.48 12.88,103.46 13.16,103.4 13.42,103.3 13.67,103.16 13.9,102.99 14.1,102.79 14.27,102.56 14.41,102.31 14.51,102.04 14.57,101.77 14.59,101.48 14.59,97.94 14.57,97.65 14.51,97.37 14.41,97.11 14.27,96.86 14.1,96.63 13.9,96.43 13.67,96.25 13.42,96.12 13.16,96.02 12.88,95.96 12.59,95.94 11.52,95.94 11.24,95.96 10.96,96.02 10.69,96.12 10.44,96.25 10.21,96.43 10.01,96.63 9.84,96.86 9.7,97.11 9.6,97.37 9.54,97.65 9.52,97.94
GNDREF on Bottom Layer: 9.52,101.48 9.54,101.77 9.6,102.04 9.7,102.31 9.84,102.56 10.01,102.79 10.21,102.99 10.44,103.16 10.69,103.3 10.96,103.4 11.24,103.46 11.52,103.48 12.59,103.48 12.88,103.46 13.16,103.4 13.42,103.3 13.67,103.16 13.9,102.99 14.1,102.79 14.27,102.56 14.41,102.31 14.51,102.04 14.57,101.77 14.59,101.48 14.59,97.94 14.57,97.65 14.51,97.37 14.41,97.11 14.27,96.86 14.1,96.63 13.9,96.43 13.67,96.25 13.42,96.12 13.16,96.02 12.88,95.96 12.59,95.94 11.52,95.94 11.24,95.96 10.96,96.02 10.69,96.12 10.44,96.25 10.21,96.43 10.01,96.63 9.84,96.86 9.7,97.11 9.6,97.37 9.54,97.65 9.52,97.94
GNDS on Bottom Layer: 5.39,106.13 2.56,104.96 1.39,102.13 1.39,5 2.57,2.17 5.4,1 152.48,1.24 155.31,2.41 156.48,5.24 156.48,102.13 155.31,104.96 152.48,106.13
VDC on Top Layer: 76.61,48.77 76.63,49.05 76.69,49.33 76.79,49.6 76.93,49.85 77.1,50.08 77.3,50.28 77.53,50.45 77.78,50.59 78.05,50.69 78.33,50.75 78.61,50.77 84.09,50.77 84.37,50.75 84.65,50.69 84.92,50.59 85.17,50.45 85.4,50.28 85.6,50.08 85.77,49.85 85.91,49.6 86.01,49.33 86.07,49.05 86.09,48.77 86.09,50 86.07,49.71 86.01,49.43 85.91,49.17 85.77,48.92 85.6,48.69 85.4,48.49 85.17,48.32 84.92,48.18 84.65,48.08 84.37,48.02 84.09,48 78.61,48 78.33,48.02 78.05,48.08 77.78,48.18 77.53,48.32 77.3,48.49 77.1,48.69 76.93,48.92 76.79,49.17 76.69,49.43 76.63,49.71 76.61,50
VDC on Top Layer: 76.62,94.95 76.64,95.23 76.7,95.51 76.8,95.78 76.93,96.03 77.11,96.26 77.31,96.46 77.54,96.63 77.79,96.77 78.05,96.87 78.33,96.93 78.62,96.95 85.19,96.95 85.47,96.93 85.75,96.87 86.02,96.77 86.27,96.63 86.5,96.46 86.7,96.26 86.87,96.03 87,95.78 87.1,95.51 87.17,95.23 87.19,94.95 87.19,95.97 87.17,95.68 87.1,95.4 87,95.14 86.87,94.89 86.7,94.66 86.5,94.46 86.27,94.29 86.02,94.15 85.75,94.05 85.47,93.99 85.19,93.97 78.62,93.97 78.33,93.99 78.05,94.05 77.79,94.15 77.54,94.29 77.31,94.46 77.11,94.66 76.93,94.89 76.8,95.14 76.7,95.4 76.64,95.68 76.62,95.97
$1N470 on Top Layer: 105.4,44.08 115.2,44.3 115.17,42.84 111.41,38.25 107.08,38.26
$1N876 on Top Layer: 104.69,75.23 114.41,76.93 114.37,75.44 110.72,69.08 106.27,69.17
$2N1504 on Top Layer: 51.89,70.44 54.68,68.57 57.97,67.92 58,68.3 58.09,68.68 58.1,68.84 58.15,69.12 58.14,69.41 58.09,71.47 57.42,73.42 56.21,74.63 51.66,79.03 51.64,79.04 51.46,79.1 51.27,79.05 51.1,78.97 50.94,78.85 50.72,78.5 50.67,78.37 50.67,72.11 50.69,71.85 50.78,71.61 50.87,71.46 51,71.33
$2N1537 on Top Layer: 96.97,86.18 96.93,86.55 96.86,86.92 96.75,87.28 96.61,87.63 96.43,87.96 96.22,88.27 95.98,88.56 95.71,88.83 95.42,89.07 95.11,89.28 94.78,89.45 94.43,89.6 94.07,89.71 93.7,89.78 93.33,89.82 92.95,89.82 92.58,89.78 92.21,89.71 91.85,89.6 91.5,89.45 91.17,89.28 90.86,89.07 90.57,88.83 90.3,88.56 90.06,88.27 89.85,87.96 89.68,87.63 89.53,87.28 89.42,86.92 89.35,86.55 89.31,86.18 89.31,85.8 89.35,85.43 89.42,85.06 89.53,84.7 89.68,84.35 89.85,84.02 90.06,83.71 90.3,83.42 90.57,83.15 90.86,82.91 91.17,82.7 91.5,82.53 91.85,82.38 92.21,82.27 92.58,82.2 92.95,82.16 93.33,82.16 93.7,82.2 94.07,82.27 94.43,82.38 94.78,82.53 95.11,82.7 95.42,82.91 95.71,83.15 95.98,83.42 96.22,83.71 96.43,84.02 96.61,84.35 96.75,84.7 96.86,85.06 96.93,85.43 96.97,85.8
$2N1556 on Top Layer: 51.88,24.47 54.67,22.6 57.96,21.95 58,22.33 58.08,22.71 58.1,22.87 58.14,23.15 58.13,23.44 58.08,25.5 57.41,27.45 56.2,28.66 51.65,33.06 51.63,33.07 51.45,33.13 51.27,33.08 51.09,33 50.93,32.88 50.71,32.53 50.67,32.4 50.67,26.14 50.69,25.88 50.77,25.64 50.87,25.49 50.99,25.36
$2N1568 on Top Layer: 96.32,39.73 96.28,40.09 96.21,40.45 96.11,40.8 95.97,41.14 95.79,41.47 95.59,41.77 95.35,42.06 95.1,42.32 94.81,42.55 94.51,42.75 94.18,42.93 93.84,43.07 93.49,43.17 93.13,43.25 92.76,43.28 92.4,43.28 92.03,43.25 91.67,43.17 91.32,43.07 90.98,42.93 90.66,42.75 90.35,42.55 90.07,42.32 89.81,42.06 89.57,41.77 89.37,41.47 89.2,41.14 89.05,40.8 88.95,40.45 88.88,40.09 88.84,39.73 88.84,39.36 88.88,38.99 88.95,38.63 89.05,38.28 89.2,37.94 89.37,37.62 89.57,37.31 89.81,37.03 90.07,36.77 90.35,36.53 90.66,36.33 90.98,36.16 91.32,36.02 91.67,35.91 92.03,35.84 92.4,35.8 92.76,35.8 93.13,35.84 93.49,35.91 93.84,36.02 94.18,36.16 94.51,36.33 94.81,36.53 95.1,36.77 95.35,37.03 95.59,37.31 95.79,37.62 95.97,37.94 96.11,38.28 96.21,38.63 96.28,38.99 96.32,39.36

Small or netless copper shapes (teardrops, artwork), in the pictures only: 337 on Top Layer, 69 on Bottom Layer

## Text on the board
Bottom Silkscreen Layer: Right | Left | Phono Preamp | EQ Amp
Top Silkscreen Layer: GND | Signal GND | 1  2  3  4  5  6 | R | L | Right | Left | Phono / Scott Carson Rev. 2 | DiscoTech | Phono Preamp | EQ Amp
